# EAGLE design Adafruit CH9328 UART to HID Keyboard Breakout (EAGLE 9.6.2)
COMPANY: ADAFRUIT INDUSTRIES; DRAWN: LADYADA; REV: A
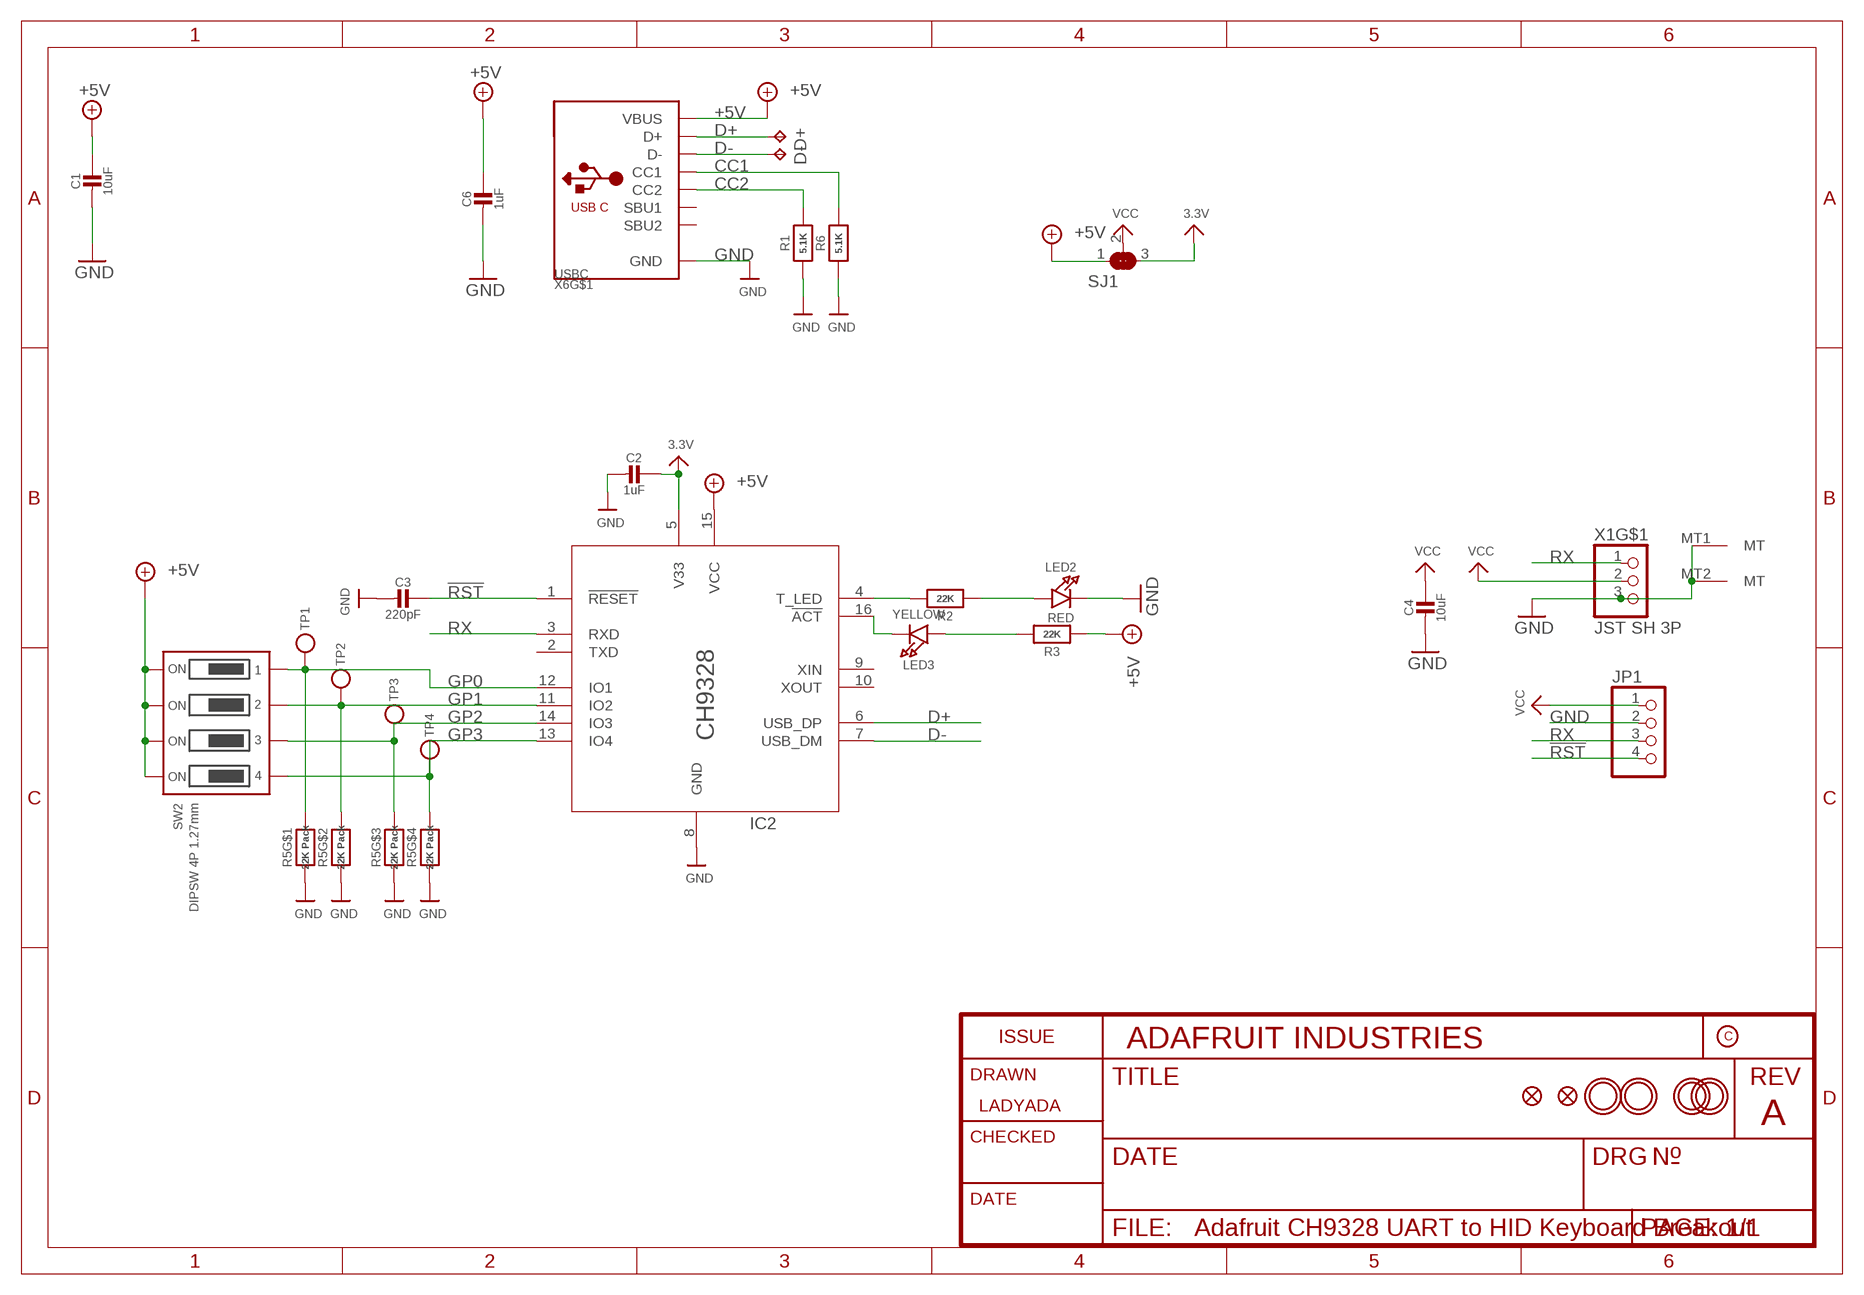
[diagram p0: schematic, sheet 1]

## Parts
C1  10uF  CAP_CERAMIC0805-NOOUTLINE  [0805-NO]
C2  1uF  CAP_CERAMIC0603_NO  [0603-NO]
C3  220pF  CAP_CERAMIC0603_NO  [0603-NO]
C4  10uF  CAP_CERAMIC0805-NOOUTLINE  [0805-NO]
C6  1uF  CAP_CERAMIC0603_NO  [0603-NO]
D+  TPTP17R  [TP17R]
D-  TPTP17R  [TP17R]
FID1  FIDUCIAL_0.5MM  [FIDUCIAL_0.5MM]
FID2  FIDUCIAL_0.5MM  [FIDUCIAL_0.5MM]
IC2  CH9328_SKINNY  [SO16_SKINNY]
JP1  HEADER-1X4ROUND  [1X04_ROUND]
LED2  RED  LED0603_NOOUTLINE  [CHIPLED_0603_NOOUTLINE]
LED3  YELLOW  LED0603_NOOUTLINE  [CHIPLED_0603_NOOUTLINE]
R1  5.1K  RESISTOR_0603_NOOUT  [0603-NO]
R2  22K  RESISTOR_0603_NOOUT  [0603-NO]
R3  22K  RESISTOR_0603_NOOUT  [0603-NO]
R5  22K Pack  RESISTOR_4PACK  [RESPACK_4X0603]
R6  5.1K  RESISTOR_0603_NOOUT  [0603-NO]
SJ1  SOLDERJUMPER_2WAY  [SOLDERJUMPER_2WAY_OPEN_NOPASTE]
SW2  DIPSW 4P 1.27mm  DIPSWITCH_4PIN_1.27  [DIPSWITCH_4PIN_1.27]
TP1  TESTPOINTROUND1.5MMNO  [TESTPOINT_ROUND_1.5MM_NO]
TP2  TESTPOINTROUND1.5MMNO  [TESTPOINT_ROUND_1.5MM_NO]
TP3  TESTPOINTROUND1.5MMNO  [TESTPOINT_ROUND_1.5MM_NO]
TP4  TESTPOINTROUND1.5MMNO  [TESTPOINT_ROUND_1.5MM_NO]
U$2  MOUNTINGHOLE2.5  [MOUNTINGHOLE_2.5_PLATED]
U$3  MOUNTINGHOLE2.5  [MOUNTINGHOLE_2.5_PLATED]
U$6  MOUNTINGHOLE2.5  [MOUNTINGHOLE_2.5_PLATED]
U$7  MOUNTINGHOLE2.5  [MOUNTINGHOLE_2.5_PLATED]
X1  JST SH 3P  CON_JST_SH_3PINHORZ  [JST_SH3]
X6  USBC  USB_C  [USB_C_CUSB31-CFM2AX-01-X]

## Nets
3.3V: C2.1 IC2.5(V33) SJ1.3
!RST: C3.1 IC2.1(!RESET) JP1.4
+5V: C1.1 C6.1 IC2.15(VCC) R3.1 SJ1.1 SW2.1ON SW2.2ON SW2.3ON SW2.4ON X6.A4B9(VBUS) X6.B4A9(VBUS)
CC1: R6.2 X6.A5(CC1)
CC2: R1.2 X6.B5(CC2)
D+: D+.TP IC2.6(USB_DP) X6.A6(D+) X6.B6(D+)
D-: D-.TP IC2.7(USB_DM) X6.A7(D-) X6.B7(D-)
GND: C1.2 C2.2 C3.2 C4.2 C6.2 IC2.8(GND) JP1.2 LED2.C R1.1 R5.1 R5.2 R5.3 R5.4 R6.1 X1.3 X1.MT1(MT) X1.MT2(MT) X6.A1B12(GND) X6.B1A12(GND)
GP0: IC2.12(IO1) R5.8 SW2.1OFF TP1.P$1
GP1: IC2.11(IO2) R5.7 SW2.2OFF TP2.P$1
GP2: IC2.14(IO3) R5.6 SW2.3OFF TP3.P$1
GP3: IC2.13(IO4) R5.5 SW2.4OFF TP4.P$1
N$2: IC2.4(T_LED) R2.2
N$3: LED2.A R2.1
N$5: LED3.A R3.2
N$7: IC2.16(!ACT) LED3.C
RX: IC2.3(RXD) JP1.3 X1.1
VCC: C4.1 JP1.1 SJ1.2 X1.2
Unconnected: IC2.2(TXD) IC2.9(XIN) IC2.10(XOUT) X6.A8(SBU1) X6.B8(SBU2) X6.M1(MT) X6.M2(MT) X6.M3(MT) X6.M4(MT)

## Library data of the parts
C1-C4 C6 = microbuilder:CAP_CERAMIC: Ceramic Capacitors For new designs, use the packages preceded by an '_' character since they are more reliable: The following footprints should be used on most boards: _0402 - Standard footprint for regular board layouts _0603 - Standard footprint for regular board layouts _0805 - Standard footprint for regular board layouts _1206 - Standard footprint for regular board layouts For extremely tight-pitch boards where space is at a premium, the following 'micro-pitch' footprints can be used (smaller pads, no silkscreen outline, etc.): _0402MP - Micro-pitch footprint for very dense/compact boards _0603MP - Micro-pitch footprint for very dense/compact boards _0805MP - Micro-pitch footprint for very dense/compact boards _1206MP - Micro-pitch footprint for very dense/compact boards
D+ D- = testpad:TP: Test pad
FID1 FID2 = microbuilder:FIDUCIAL: Fiducial Alignment Points Various fiducial points for machine vision alignment.
IC2 = adafruit_micro:CH9328
JP1 = microbuilder:HEADER-1X4: PIN HEADER
LED2 LED3 = microbuilder:LED: LED 0603 - 0603 Surface Mount Package 2mA: Green LED - Low Power (3.9mcd, 2ma, 1.7Vf) - Digikey: 475-2709-2-ND Orange LED - Low Power (9.8mcd, 2ma, 1.8Vf) - Digikey: 475-1194-2-ND Red LED - Low Power (5mcd, 2ma, 1.8Vf) - Digikey: 475-1195-2-ND Yellow LED - Low Power (7mcd, 2ma, 1.8Vf) - Digikey: 475-1196-2-ND 5mA: Blue LED - Low Power (17mcd, 5ma, 2.9Vf) - Digikey: LNJ937W8CRACT-ND 0805 - 0805 Surface Mount Package 2mA: Red LED (8.8mcd, 2mA, 1.8Vf, Clear) - Low Power [Digikey: 475-2510-1-ND] Green LED (5mcd, 2mA, 1.8Vf, Clear) - Low Power [Digikey: 475-2730-1-ND] Yellow LED (11.3mcd, 2mA, 1.8Vf, Clear) - Low Power [Digikey: 475-2555-1-ND] 20mA: Red LED (104mcd, 20mA, Diffused) - LS R976 [Digikey: 475-1278-6-ND] Red LED (12mcd, 20mA, 2.0Vf, Clear) - APT2012EC [Digikey: 754-1128-1-ND] Green LED (15mcd, 20mA, 2.2Vf, Clear) - APT2012GC [Digikey: 754-1131-1-ND] Orange LED (160mcd, 20mA, 2.1Vf, Clear) - APT2012SECK [Digikey: 754-1130-1-ND] 1206 - 1206 Surface Mount Package Green LED (26mcd, 20mA, Diffused) - LG N971 [Digikey: 475-1407-6-ND] Red LED (15mcd, 20mA, Diffused) - LH N974 [Digikey: 475-1416-6-ND] Cree - Cree High-Power Surface Mount LEDs XPEBWT-L1-0000-00D50 - White 111lm 350mA 2.9Vf 6200K 110° XTEAWT-00-0000-00000LEE3 - White 114lm 350mA 2.85Vf 5000K 115° Everlight - Everlight 45-21 Series Surface Mount LEDs 45-21/QK2C-B2832AC2CB2/2T - Warm White 2000mcd 20mA 3.25Vf 3050K 120° 45-21/LK2C-B38452C4CB2/2T - Nuetral White 2000mcd 20mA 3.25Vf 4150K 120° 45-21/LK2C-B50634C6CB2/2T - Cold White 2200mcd 20mA 3.25Vf 5650K 120° PLCC2 Reverse Mount LS T77K-J1L2-1-0-2-R18-Z - Red 11.25mcd 2mA 1.8Vf 630nm 120° LO T77K-L1M2-24-Z - Orange 19.6mcd 2mA 1.8Vf 606nm 120° LY T77K-K2M1-26-Z - Yellow 15.7mcd 2mA 1.8Vf 587nm 120°; ROT: 270
R1-R3 R6 = microbuilder:RESISTOR: Resistors For new designs, use the packages preceded by an '_' character since they are more reliable: The following footprints should be used on most boards: _0402 - Standard footprint for regular board layouts _0603 - Standard footprint for regular board layouts _0805 - Standard footprint for regular board layouts _1206 - Standard footprint for regular board layouts For extremely tight-pitch boards where space is at a premium, the following 'micro-pitch' footprints can be used (smaller pads, no silkscreen outline, etc.): _0402MP - Micro-pitch footprint for very dense/compact boards _0603MP - Micro-pitch footprint for very dense/compact boards _0805MP - Micro-pitch footprint for very dense/compact boards _1206MP - Micro-pitch footprint for very dense/compact boards
R5 = microbuilder:RESISTOR_4PACK: Resistor Packs (4 resistors) 4 x 0603 10K 1/16W - Digikey: YC164J-10KCT-ND
SJ1 = microbuilder:SOLDERJUMPER_2WAY: 2-Way Solder Jumper
SW2 = adafruit_electromech:DIPSWITCH_4PIN: DIP Switch - 4 Pin - [4UConnector: 19494]
TP1-TP4 = microbuilder:TESTPOINT: Test Point Various test points for characterisation and PCB testing TESTPOINT_SMT - Compact Surface Mount Test Point [Digikey: 5016KTR-ND]
U$2 U$3 U$6 = adafruit_electromech:MOUNTINGHOLE: Mounting Hole For #2 screws (0.086"/2.18mm width, 0.094"/2.4mm hole) use 2.5mm; BOM: EXCLUDE; REV: B
U$7 = adafruit_electromech:MOUNTINGHOLE: Mounting Hole For #2 screws (0.086"/2.18mm width, 0.094"/2.4mm hole) use 2.5mm; BOM: EXCLUDE
X1 = adafruit_electromech:CON_JST_SH_3PIN
X6 = adafruit_electromech:USB_C: USB Type-C USB 2.0 Connector; LCSC: C165948

## Net classes
1 power: width 0.305 mm
2 gnd: width 0.254 mm

## Board
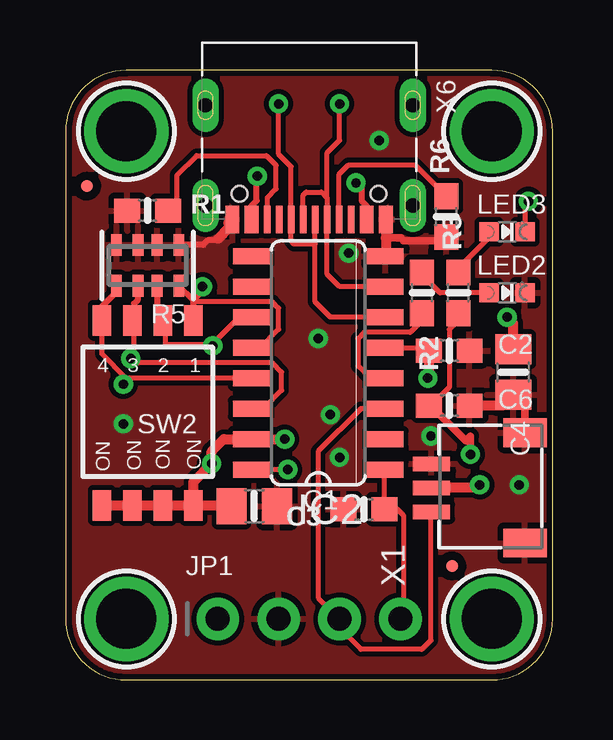
[diagram p1: board, top side]
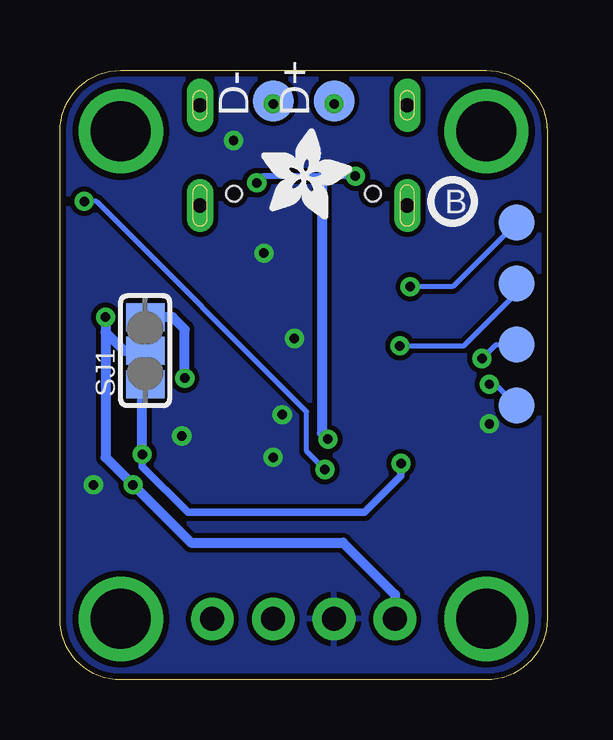
[diagram p2: board, bottom side, seen from below]

Size 20.32 x 25.4 mm. Coordinates in mm from the lower left corner, seen from the top.
Outline: 17.78,25.4 2.54,25.4 arc90 0,22.86 0,2.54 arc90 2.54,0 17.78,0 arc90 20.32,2.54 20.32,22.86 arc90 17.78,25.4
Copper layers (1*16): Top 0.035mm / dielectric 1.5mm / Bottom 0.035mm
Design rules "adafruit *": minimum track width 8mil, minimum drill 15.5mil, track to track 8mil, track to pad 8mil, pad to pad 8mil, via to via 8mil, smd to smd 8mil, copper to edge 10mil, drill to drill 8mil, minimum pad ring 10mil, minimum via ring 8mil, stop-mask expansion 2mil, vias tented up to drill 20mil, thermal gap 10mil

### Footprints (pad centres in the part's own frame; a part is rotated, then mirrored left to right if it is on the bottom)
0805-NO = smd 1.24 x 1.5: 1 -0.95,0; 2 0.95,0
0603-NO = smd 1.075 x 1: 1 -0.85,0; 2 0.85,0
TP17R = smd 1.7 x 1.7: TP 0,0
FIDUCIAL_0.5MM = smd 0.5 x 0.5: 1 0,0
SO16_SKINNY = smd 0.66 x 1.524: 1 -4.445,-2.794; 2 -3.175,-2.794; 3 -1.905,-2.794; 4 -0.635,-2.794; 5 0.635,-2.794; 6 1.905,-2.794; 7 3.175,-2.794; 8 4.445,-2.794; 9 4.445,2.794; 10 3.175,2.794; 11 1.905,2.794; 12 0.635,2.794; 13 -0.635,2.794; 14 -1.905,2.794; 15 -3.175,2.794; 16 -4.445,2.794
1X04_ROUND = drill 1 pad 1.778: 1 -3.81,0; 2 -1.27,0; 3 1.27,0; 4 3.81,0
CHIPLED_0603_NOOUTLINE = smd 0.8 x 0.8: A 0,-0.75; C 0,0.75
RESPACK_4X0603 = smd 0.45 x 0.9: 1 -1.3,-0.85; 2 -0.4,-0.85; 3 0.4,-0.85; 4 1.3,-0.85; 5 1.3,0.85; 6 0.4,0.85; 7 -0.4,0.85; 8 -1.3,0.85
SOLDERJUMPER_2WAY_OPEN_NOPASTE = smd 1.168 x 1.6: 1 -1.397,0; 2 0,0; 3 1.397,0
DIPSWITCH_4PIN_1.27 = smd 0.76 x 1.27: 1OFF -1.905,-3.8; 1ON -1.905,3.9; 2OFF -0.635,-3.8; 2ON -0.635,3.9; 3OFF 0.635,-3.8; 3ON 0.635,3.9; 4OFF 1.905,-3.8; 4ON 1.905,3.9
TESTPOINT_ROUND_1.5MM_NO = smd 1.5 x 1.5: P$1 0,0
MOUNTINGHOLE_2.5_PLATED = drill 2.5 pad 3.2: P$1 0,0
JST_SH3 = smd 0.6 x 1.55: 1 -1,2.006; 2 0,2.006; 3 1,2.006 | smd 1.2 x 1.8: MT1 -2.3,-1.894; MT2 2.3,-1.894
USB_C_CUSB31-CFM2AX-01-X = smd 0.575 x 1.15: A1B12 -3.2,2.275; A4B9 -2.4,2.275; B1A12 3.2,2.275; B4A9 2.4,2.275 | smd 0.275 x 1.15: A5 -1.25,2.275; A6 -0.25,2.275; A7 0.25,2.275; A8 1.25,2.275; B5 1.75,2.275; B6 0.75,2.275; B7 -0.75,2.275; B8 -1.75,2.275 | drill 0.6 pad 1 long: M1 -4.32,1.7; M2 4.32,1.7; M3 -4.32,-2.48; M4 4.32,-2.48 | hole 0.65: 2.89,1.2; -2.89,1.2

### Placement (x,y rotation side)
C1  7.87,7.24 0 top
C2  16,13.72 0 top
C3  12.45,7.11 180 top
C4  18.67,12.83 270 top
C6  16,11.43 0 top
D+  8.89,24.13 90 bottom
D-  11.43,24.13 90 bottom
FID1  16.12,4.75 270 top
FID2  0.89,20.57 270 top
IC2  10.54,13.21 90 top
JP1  10.16,2.54 0 top
LED2  18.41,16.13 270 top
LED3  18.41,18.67 270 top
PLABEL0  [PLABEL0]  18.41,17.4 0 top
PLABEL1  [PLABEL1]  18.41,19.94 0 top
PLABEL2  [PLABEL2]  11.56,0.89 0 top
PLABEL3  [PLABEL3]  14.22,0.89 0 top
PLABEL4  [PLABEL4]  8.89,0.89 0 top
PLABEL5  [PLABEL5]  5.59,0.89 0 top
PLABEL6  [PLABEL6]  5.33,5.97 0 top
PLABEL7  [PLABEL7]  4.06,5.97 0 top
PLABEL8  [PLABEL8]  2.79,5.97 0 top
PLABEL9  [PLABEL9]  1.52,5.97 0 top
PLABEL10  [PLABEL10]  0.89,17.91 270 top
PLABEL11  [PLABEL11]  10.03,4.83 0 top
PLABEL12  [PLABEL12]  17.27,8.13 0 bottom
PLABEL13  [PLABEL13]  17.14,9.4 0 bottom
PLABEL14  [PLABEL14]  17.78,6.73 0 bottom
PLABEL15  [PLABEL15]  17.53,17.02 0 bottom
PLABEL16  [PLABEL16]  19.05,12.32 0 bottom
PLABEL17  [PLABEL17]  19.05,14.99 0 bottom
PLABEL18  [PLABEL18]  8.51,14.99 0 bottom
PLABEL19  [PLABEL19]  7.37,7.75 0 bottom
PLABEL20  [PLABEL20]  19.56,7.87 90 bottom
PLABEL21  [PLABEL21]  7.37,24 90 bottom
PLABEL22  [PLABEL22]  12.95,24 90 bottom
R1  3.43,19.56 0 top
R2  14.86,16.13 270 top
R3  16.38,16.13 90 top
R5  3.43,17.27 180 top
R6  15.88,19.3 90 top
SJ1  16.76,13.72 90 bottom
SW2  3.43,11.18 180 top
TP1  1.27,19.05 0 bottom
TP2  1.27,16.51 0 bottom
TP3  1.27,13.97 0 bottom
TP4  1.27,11.43 0 bottom
U$2  17.78,22.86 270 top
U$3  2.54,22.86 270 top
U$6  17.78,2.54 270 top
U$7  2.54,2.54 270 top
U$17  [ADAFRUIT_3.5MM]  11.94,19.18 0 bottom
U$18  [PCBFEAT-REV-040]  3.94,19.94 0 bottom
X1  17.27,8 90 top
X6  10.16,21.46 180 top

### Tracks (layer width: path | path; a pad name or v marks a point on that pad's centre or on a via)
3.3V  (via drill 0.39)
  Top 0.203: IC2.5 15.03,13.84 C2.1
  Top 0.406: C2.1 15.15,12.61 v15.11,12.57
  Bottom 0.406: v15.11,12.57 15.11,14.61 15.62,15.11 SJ1.3
!RST
  Top 0.203: IC2.1 13.3,8.72 C3.1 13.84,7.11 14.1,6.85 14.1,2.67 JP1.4
+5V  (via drill 0.39)
  Top 0.203: 15.49,11.43 C6.1 15.24,11.43 16,12.19 16,14.61 16.38,14.99 R3.1
  Top 0.254: X6.B4A9 7.76,19.75 7.98,19.97 7.98,20.96 v8,20.99 | v12.12,20.71 12.34,20.48 12.34,19.97 12.56,19.75 X6.A4B9
  Top 0.305: v16.89,9.4 16.89,10.16 16.7,9.97 15.49,11.18 15.49,11.43
  Top 0.406: SW2.4ON SW2.3ON SW2.2ON SW2.1ON | SW2.1ON 5.33,8.26 v6.1,9.02 6.1,9.53 6.6,10.03 IC2.15 v9.14,10.03 | SW2.1ON 6.89,7.28 C1.1
  Bottom 0.254: v8,20.99 9.4,20.99 11.84,20.99 v12.12,20.71
  Bottom 0.305: v16.89,9.4 16.89,8.89 14.99,6.99 7.62,6.99 6.1,8.51 v6.1,9.02
  Bottom 0.406: 9.4,20.99 9.4,10.29 v9.14,10.03 | v16.89,9.4 16.89,12.19 SJ1.1
CC1
  Top 0.203: R6.2 14.57,21.46 11.81,21.46 11.41,21.06 X6.A5
CC2
  Top 0.203: R1.2 4.66,19.94 4.66,21.04 5.46,21.84 8.38,21.84 8.79,21.43 8.79,20.46 8.41,20.08 X6.B5
D+  (via drill 0.39)
  Top 0.203: IC2.6 11.05,15.11 10.41,15.75 10.41,18.16 | 10.41,18.16 X6.A6 | 10.41,18.16 9.53,18.16 9.4,18.29 9.4,19.18 X6.B6 9.41,21.39 8.89,21.91 v8.89,24
  Bottom 0.203: D+.TP v8.89,24
D-  (via drill 0.39)
  Top 0.203: IC2.7 11.43,16.38 10.91,16.9 X6.B7 10.91,20.08 | X6.A7 9.91,20.2 10.03,20.32 10.67,20.32 10.91,20.08 | 10.91,20.08 10.91,21.96 11.43,22.48 v11.43,24
  Bottom 0.203: D-.TP v11.43,24
GND  (via drill 0.39)
  Top 0.254: 6.38,18.39 6.3,18.31 5.93,18.31 5.74,18.12 R5.1
  Top 0.305: 13.36,18.41 13.99,18.41 14.1,18.3 15.72,18.3 R6.1 | C4.2 19.17,11.38 X1.MT2
  Top 0.406: X6.A1B12 13.36,18.41 13.36,17.66 | X6.B1A12 6.8,19.03 6.8,18.81 6.38,18.39 | C4.2 18.22,11.43 C6.2
  other vias: 11.43,9.27 15.24,10.16 18.92,8.13 11.81,17.78 10.54,14.22 11.05,11.05 2.41,10.67 13.08,22.48
  pour Top: 20.32,25.4 20.32,0 0,0 0,25.4
  pour Bottom: 20.32,25.4 20.32,0 0,0 0,25.4
GP0  (via drill 0.39)
  Top 0.203: IC2.12 8.13,13.84 8.89,14.61 8.89,15.49 8.64,15.75 5.33,15.75 | v5.71,16.38 5.71,16.2 5.33,15.82
  Top 0.254: SW2.1OFF 5.33,15.75 5.33,15.82 R5.8
  Bottom 0.203: TP1.P$1 3.94,16.38 v5.71,16.38
GP1  (via drill 0.39)
  Top 0.203: IC2.11 7.64,15.01 7.14,15.01 6.22,14.1 | 6.22,14.1 6.1,13.97 4.19,13.97 4.19,14.85 SW2.2OFF 4.06,15.24 3.86,15.44 | 6.22,14.1 6.22,14 v6.15,13.92
  Top 0.254: 3.86,15.44 3.83,15.41 R5.7
  Bottom 0.203: v6.15,13.92 3.48,13.92 1.27,16.13 TP2.P$1
GP2  (via drill 0.39)
  Top 0.203: IC2.14 8.26,11.3 9.02,12.06 9.02,12.83 8.64,13.21 3.05,13.21 2.86,13.39 2.86,13.53 | 2.86,13.53 2.86,14.91 SW2.3OFF 2.86,15.04 2.86,15.68 | 2.86,13.53 v2.72,13.39
  Top 0.254: 2.86,15.68 3.03,15.85 R5.6
  Bottom 0.203: v2.72,13.39 2.14,13.97 TP3.P$1
GP3  (via drill 0.39)
  Top 0.203: IC2.13 2.54,12.57 | 2.54,12.57 1.52,13.59 SW2.4OFF | 2.54,12.57 2.35,12.38 v2.41,12.32
  Top 0.254: SW2.4OFF 1.52,15.56 2.13,16.17 R5.5
  Bottom 0.203: TP4.P$1 2.16,12.32 v2.41,12.32
N$1
  Bottom 0.305: 16.76,12.83 16.76,13.21
N$2
  Top 0.203: IC2.4 12.7,12.57 12.19,13.08 12.19,14.22 12.45,14.48 14.38,14.48 14.68,14.78 14.68,15.01
  Top 0.305: R2.2 14.86,15.18 14.68,15.01
N$3
  Top 0.203: R2.1 14.86,16.89 15.62,16.13 LED2.A
N$5
  Top 0.203: R3.2 16.38,17.14 17.66,18.43 LED3.A
N$7  (via drill 0.39)
  Top 0.203: v9.27,8.76 IC2.16 | v19.3,19.94 19.16,19.8 LED3.C
  Bottom 0.203: v9.27,8.76 10.03,9.53 10.03,11.18 18.8,19.94 v19.3,19.94
RX
  Top 0.203: IC2.3 12.32,11.3 10.54,9.53 10.54,3.43 JP1.3 11.43,2.16 12.32,1.27 14.86,1.27 15.24,1.65 15.24,6.97 X1.1
VCC  (via drill 0.39)
  Top 0.406: C4.1 18.67,14.86 v18.41,15.11 | v17.27,8.13 17.14,8 X1.2
  Bottom 0.406: v18.41,15.11 18.41,14.48 | 18.41,14.48 17.65,13.72 SJ1.2 | 18.41,14.48 18.41,9.27 v17.27,8.13 14.86,5.71 8.51,5.71 6.35,3.56 JP1.1

### Text on the board
Pinguin_tBackup: HID | MODE | USB | 4 | 3 | 2 | 1 | CH9328 | VCC | GND | RX | RST
Pinguin_bBackup: D+ | D- | VCC | CH9328 / UART to HID / Keyboard | 3V | 5V | GND | Use DIP Switches / To Set Mode / Default 9600bps | VCC | RX | JST SH